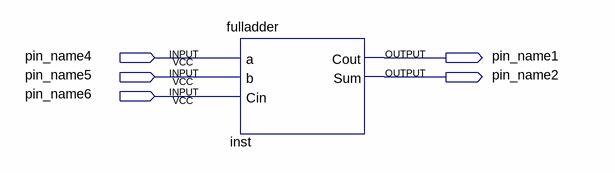
[diagram p0: schematic sheet]
// Quartus schematic TOPLEVEL.bdf as structural Verilog: 1 symbols, 5 pins
module TOPLEVEL (
  input  pin_name4,
  input  pin_name5,
  input  pin_name6,
  output pin_name1,
  output pin_name2
);

  fulladder inst (.a(pin_name4), .b(pin_name5), .Cin(pin_name6), .Cout(pin_name1), .Sum(pin_name2));
endmodule
